# Altium project SC60224.PrjPcb
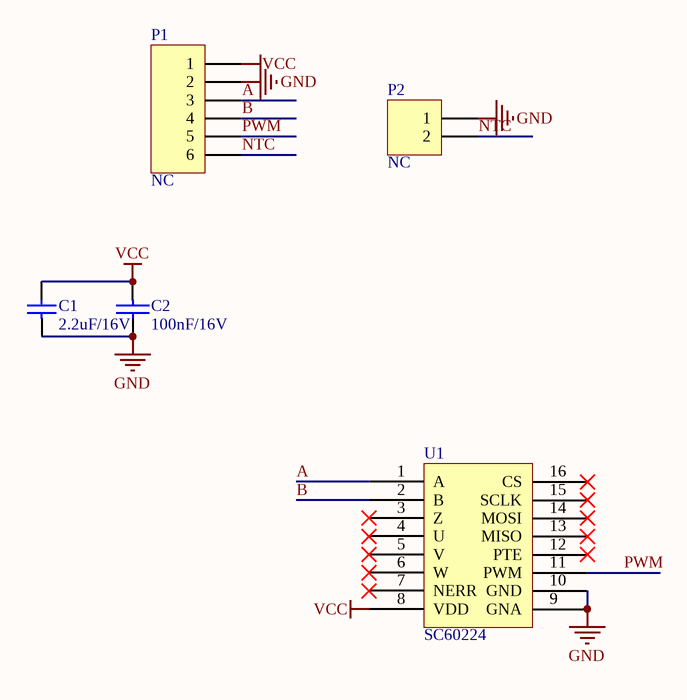
[diagram p0: SC60224.SchDoc]
1 sheet, 5 parts. Net scope: global (net labels, ports and power ports of the same name join across sheets).
Board file: SC60224.PcbDoc

## Sheet SC60224.SchDoc
size A4

### Parts
C1  2.2uF/16V  [C0603]
C2  100nF/16V  [C0402]
P1  NC  [HDR1X6]
P2  NC  [HDR1X2]
U1  SC60224  [SSOP-16]

### Nets
GND: C1.1 C2.2 P1.2 P2.1 U1.9(GNA) U1.10(GND)
VCC: C1.2 C2.1 P1.1 U1.8(VDD)
A: P1.3 U1.1(A)
B: P1.4 U1.2(B)
NTC: P1.6 P2.2
PWM: P1.5 U1.11(PWM)

Not connected (* = marked no-connect by the designer): U1 3(Z)* 4(U)* 5(V)* 6(W)* 7(NERR)* 12(PTE)* 13(MISO)* 14(MOSI)* 15(SCLK)* 16(CS)*

### Library data of the parts
C1 = cap
C2 = CAP: Capacitor
P1 = Header 6: Header, 6-Pin; LatestRevisionDate: 17-Jul-2002; LatestRevisionNote: Re-released for DXP Platform.; Publisher: Altium Limited
P2 = Header 2: Header, 2-Pin; LatestRevisionDate: 17-Jul-2002; LatestRevisionNote: Re-released for DXP Platform.; Publisher: Altium Limited